# Altium schematic sheet SP8T_ecal_1.SchDoc
size B; SheetNumber: 1; SheetTotal: 3; SCH_REV: 2.0; SCH_TITLE_1: PXIe SP8T RF; SCH_TITLE_2: SCHEMATIC
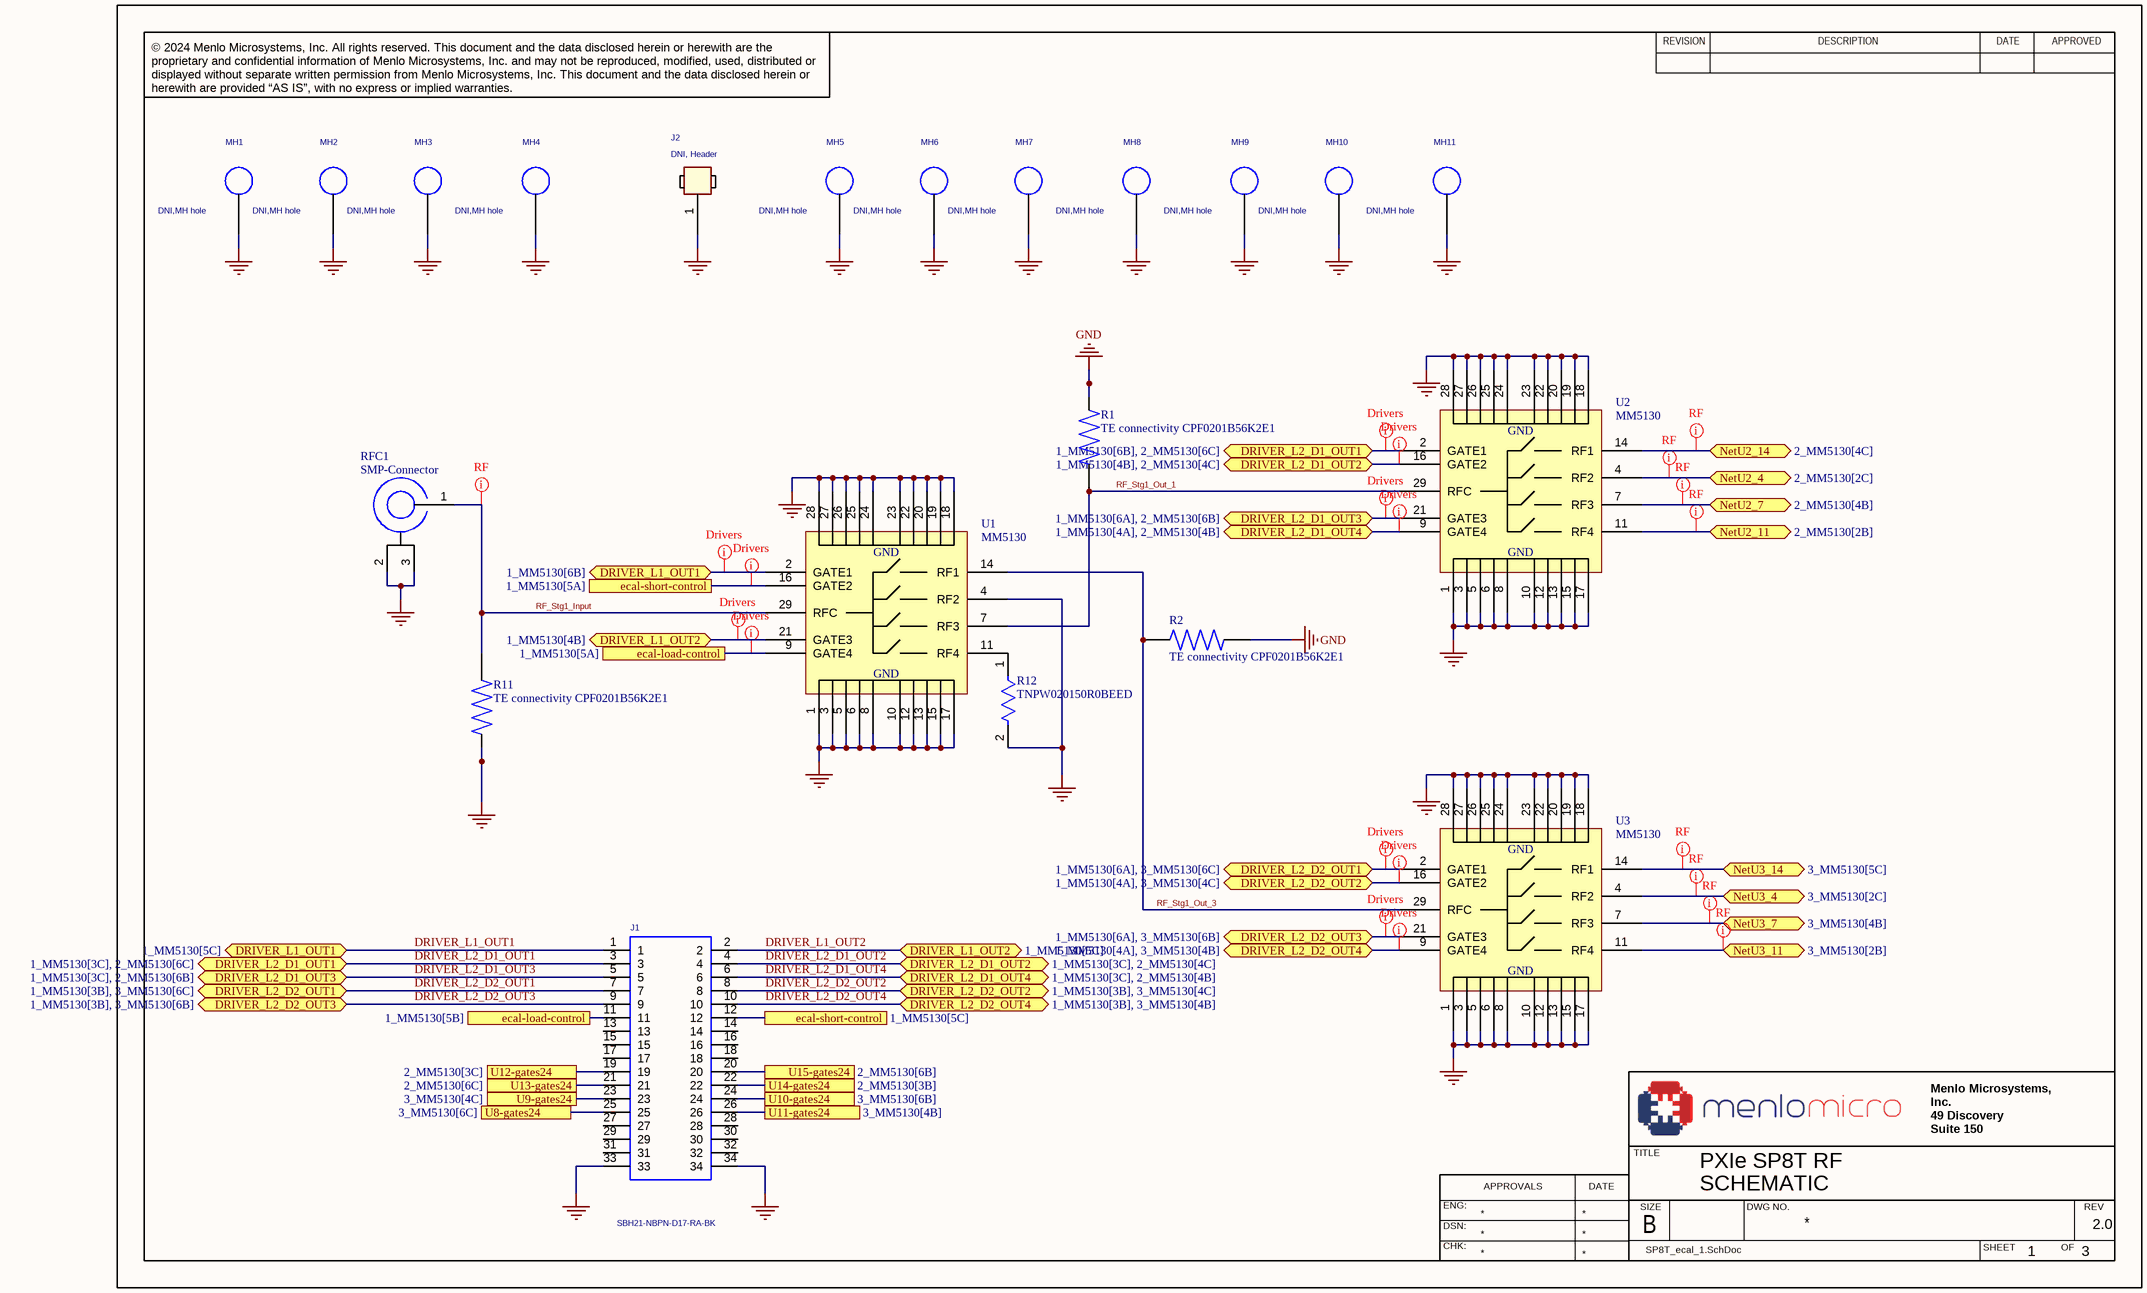
[diagram p0: SP8T_ecal_1.SchDoc]

## Parts
J1  SBH21-NBPN-D17-RA-BK  [SULLINS_SBH21-NBPN-D17-ST-B]
J2  DNI, Header  [tp_0035]
MH1  DNI,MH hole  [MH]
MH2  DNI,MH hole  [MH]
MH3  DNI,MH hole  [MH]
MH4  DNI,MH hole  [MH]
MH5  DNI,MH hole  [MH_55]
MH6  DNI,MH hole  [MH_55]
MH7  DNI,MH hole  [MH_55]
MH8  DNI,MH hole  [MH_55]
MH9  DNI,MH hole  [MH_55]
MH10  DNI,MH hole  [MH_55]
MH11  DNI,MH hole  [MH_55]
R1  TE connectivity CPF0201B56K2E1  [0201-resistor]
R2  TE connectivity CPF0201B56K2E1  [0201-resistor]
R11  TE connectivity CPF0201B56K2E1  [0201-resistor]
R12  TNPW020150R0BEED  [FP-ERJ1GN-IPC_C]
RFC1  Type: SMP-Connector  [CONN-PE44490]  (hidden comment: PE44490)
U1  MM5130  [MM5130-NORM_PCB_NOFLOOD]
U2  MM5130  [MM5130-NORM_PCB_NOFLOOD]
U3  MM5130  [MM5130-NORM_PCB_NOFLOOD]

## Ports
DRIVER_L1_OUT1 (bidir, see 1_MM5130[5C]), DRIVER_L1_OUT1 (bidir, see 1_MM5130[6B]), DRIVER_L1_OUT2 (bidir, see 1_MM5130[4B]), DRIVER_L1_OUT2 (bidir, see 1_MM5130[5C]), DRIVER_L2_D1_OUT1 (bidir, see 1_MM5130[3C], 2_MM5130[6C]), DRIVER_L2_D1_OUT1 (bidir, see 1_MM5130[6B], 2_MM5130[6C]), DRIVER_L2_D1_OUT2 (bidir, see 1_MM5130[3C], 2_MM5130[4C]), DRIVER_L2_D1_OUT2 (bidir, see 1_MM5130[4B], 2_MM5130[4C]), DRIVER_L2_D1_OUT3 (bidir, see 1_MM5130[3C], 2_MM5130[6B]), DRIVER_L2_D1_OUT3 (bidir, see 1_MM5130[6A], 2_MM5130[6B]), DRIVER_L2_D1_OUT4 (bidir, see 1_MM5130[3C], 2_MM5130[4B]), DRIVER_L2_D1_OUT4 (bidir, see 1_MM5130[4A], 2_MM5130[4B]), DRIVER_L2_D2_OUT1 (bidir, see 1_MM5130[3B], 3_MM5130[6C]), DRIVER_L2_D2_OUT1 (bidir, see 1_MM5130[6A], 3_MM5130[6C]), DRIVER_L2_D2_OUT2 (bidir, see 1_MM5130[3B], 3_MM5130[4C]), DRIVER_L2_D2_OUT2 (bidir, see 1_MM5130[4A], 3_MM5130[4C]), DRIVER_L2_D2_OUT3 (bidir, see 1_MM5130[3B], 3_MM5130[6B]), DRIVER_L2_D2_OUT3 (bidir, see 1_MM5130[6A], 3_MM5130[6B]), DRIVER_L2_D2_OUT4 (bidir, see 1_MM5130[3B], 3_MM5130[4B]), DRIVER_L2_D2_OUT4 (bidir, see 1_MM5130[4A], 3_MM5130[4B]), ecal-load-control (see 1_MM5130[5A]), ecal-load-control (see 1_MM5130[5B]), ecal-short-control (see 1_MM5130[5A]), ecal-short-control (see 1_MM5130[5C]), NetU2_4 (bidir, see 2_MM5130[2C]), NetU2_7 (bidir, see 2_MM5130[4B]), NetU2_11 (bidir, see 2_MM5130[2B]), NetU2_14 (bidir, see 2_MM5130[4C]), NetU3_4 (bidir, see 3_MM5130[2C]), NetU3_7 (bidir, see 3_MM5130[4B]), NetU3_11 (bidir, see 3_MM5130[2B]), NetU3_14 (bidir, see 3_MM5130[5C]), U8-gates24 (see 3_MM5130[6C]), U9-gates24 (see 3_MM5130[4C]), U10-gates24 (see 3_MM5130[6B]), U11-gates24 (see 3_MM5130[4B]), U12-gates24 (see 2_MM5130[3C]), U13-gates24 (see 2_MM5130[6C]), U14-gates24 (see 2_MM5130[3B]), U15-gates24 (see 2_MM5130[6B])

## Nets
GND: J1.33 J1.34 J2.1 MH1.1 MH2.1 MH3.1 MH4.1 MH5.1 MH6.1 MH7.1 MH8.1 MH9.1 MH10.1 MH11.1 R1.2 R2.1 R11.2 R12.2 RFC1.2 RFC1.3 U1.1(GND) U1.3(GND) U1.4(RF2) U1.5(GND) U1.6(GND) U1.8(GND) U1.10(GND) U1.12(GND) U1.13(GND) U1.15(GND) U1.17(GND) U1.18(GND) U1.19(GND) U1.20(GND) U1.22(GND) U1.23(GND) U1.24(GND) U1.25(GND) U1.26(GND) U1.27(GND) U1.28(GND) U2.1(GND) U2.3(GND) U2.5(GND) U2.6(GND) U2.8(GND) U2.10(GND) U2.12(GND) U2.13(GND) U2.15(GND) U2.17(GND) U2.18(GND) U2.19(GND) U2.20(GND) U2.22(GND) U2.23(GND) U2.24(GND) U2.25(GND) U2.26(GND) U2.27(GND) U2.28(GND) U3.1(GND) U3.3(GND) U3.5(GND) U3.6(GND) U3.8(GND) U3.10(GND) U3.12(GND) U3.13(GND) U3.15(GND) U3.17(GND) U3.18(GND) U3.19(GND) U3.20(GND) U3.22(GND) U3.23(GND) U3.24(GND) U3.25(GND) U3.26(GND) U3.27(GND) U3.28(GND)
DRIVER_L1_OUT1: J1.1 U1.2(GATE1) ; port DRIVER_L1_OUT1
DRIVER_L1_OUT2: J1.2 U1.21(GATE3) ; port DRIVER_L1_OUT2
DRIVER_L2_D1_OUT1: J1.3 U2.2(GATE1) ; port DRIVER_L2_D1_OUT1
DRIVER_L2_D1_OUT2: J1.4 U2.16(GATE2) ; port DRIVER_L2_D1_OUT2
DRIVER_L2_D1_OUT3: J1.5 U2.21(GATE3) ; port DRIVER_L2_D1_OUT3
DRIVER_L2_D1_OUT4: J1.6 U2.9(GATE4) ; port DRIVER_L2_D1_OUT4
DRIVER_L2_D2_OUT1: J1.7 U3.2(GATE1) ; port DRIVER_L2_D2_OUT1
DRIVER_L2_D2_OUT2: J1.8 U3.16(GATE2) ; port DRIVER_L2_D2_OUT2
DRIVER_L2_D2_OUT3: J1.9 U3.21(GATE3) ; port DRIVER_L2_D2_OUT3
DRIVER_L2_D2_OUT4: J1.10 U3.9(GATE4) ; port DRIVER_L2_D2_OUT4
ecal-load-control: J1.11 U1.9(GATE4) ; port ecal-load-control
ecal-short-control: J1.12 U1.16(GATE2) ; port ecal-short-control
NetU2_4: U2.4(RF2) ; port NetU2_4
NetU2_7: U2.7(RF3) ; port NetU2_7
NetU2_11: U2.11(RF4) ; port NetU2_11
NetU2_14: U2.14(RF1) ; port NetU2_14
NetU3_4: U3.4(RF2) ; port NetU3_4
NetU3_7: U3.7(RF3) ; port NetU3_7
NetU3_11: U3.11(RF4) ; port NetU3_11
NetU3_14: U3.14(RF1) ; port NetU3_14
RF_Stg1_Input: R11.1 RFC1.1 U1.29(RFC)
RF_Stg1_Out_1: R1.1 U1.7(RF3) U2.29(RFC)
RF_Stg1_Out_3: R2.2 U1.14(RF1) U3.29(RFC)
U8-gates24: J1.25 ; port U8-gates24
U9-gates24: J1.23 ; port U9-gates24
U10-gates24: J1.24 ; port U10-gates24
U11-gates24: J1.26 ; port U11-gates24
U12-gates24: J1.19 ; port U12-gates24
U13-gates24: J1.21 ; port U13-gates24
U14-gates24: J1.22 ; port U14-gates24
U15-gates24: J1.20 ; port U15-gates24
NetR12_1: R12.1 U1.11(RF4)

Not connected (* = marked no-connect by the designer): J1 13 14 15 16 17 18 27 28 29 30 31 32

## Layout directives
net class Drivers: DRIVER_L1_OUT1, DRIVER_L1_OUT2, DRIVER_L2_D1_OUT1, DRIVER_L2_D1_OUT2, DRIVER_L2_D1_OUT3, DRIVER_L2_D1_OUT4, DRIVER_L2_D2_OUT1, DRIVER_L2_D2_OUT2, DRIVER_L2_D2_OUT3, DRIVER_L2_D2_OUT4, ecal-load-control, ecal-short-control
net class RF: NetU2_4, NetU2_7, NetU2_11, NetU2_14, NetU3_4, NetU3_7, NetU3_11, NetU3_14, RF_Stg1_Input

## Notes on the sheet
- © 2024 Menlo Microsystems, Inc. All rights reserved. This document and the data disclosed herein or herewith are the proprietary and confidential information of Menlo Microsystems, Inc. and may not be reproduced, modified, used, distributed or displayed without separate written permission from Menlo Microsystems, Inc. This document and the data disclosed herein or herewith are provided “AS IS”, with no express or implied warranties.
- REVISION
- DESCRIPTION
- DATE
- APPROVED
- TITLE
- Menlo Microsystems, Inc.
  49 Discovery
  Suite 150
  Irvine, CA 92618
- ENG:
- DSN:
- CHK:
- APPROVALS
- SIZE
- B
- DWG NO.
- SHEET
- OF
- REV

## Library data of the parts
J1 = SBH21-NBPN-D17-ST-BK: Connector Header Through Hole 34 position 0.079 _2.00mm_; OriginalSymbolOrigin: (-30000,90000); Package: None; Availability: Unavailable; Price: None
J2 = HEADER 1
MH1-MH11 = M HOLE1_0
R1 R2 R11 = TE connectivity CPF0201B56K2E1: CPF 0201 56K2 0.1% 25PPM 1K RL; MP: ERJ1GN0R00C; Value: 56k; Availability: Unavailable; Price: None; Package: None; Mfgr: TE connectivity; Mfgr Part No.: CPF0201B56K2E1
R12 = CMP-1010-00416-3: RES SMD 50 OHM 0.1% 1/20W 0201; Temperature Coefficient: 200ppm/°C; Resistance Tolerance: 1%; Max Power Dissipation: 50mW; Voltage Rating (DC): 25V; Resistance: 1kR; Number of Pins: 2; Height: 0.01inch; Weight: 6E-06oz; Min Operating Temperature: -55°C; Features: Automotive AEC-Q200; Radiation Hardening: No; Resistor Type: Thick Film; RoHS Compliant: Yes; Termination: SMD/SMT; Package Quantity: 15000; Size Code: 0201; Case Code (Imperial): 0201; Contact Plating: Tin; Case/Package: 0201; Lead Free: Lead Free; Number of Terminations: 2; Tolerance: 1%; Max Operating Temperature: 125°C; Mount: Surface Mount; Width: 0.012inch; Series: ERJ; Voltage Rating: 25V; Power Rating: 50mW; Packaging: Tape and Reel; Length: 0.6mm; Case Code (Metric): 0603
RFC1 = CONN-PE44490: SMP, Mini Connector Plug, Male Pin 50 Ohms Board Edge, Cutout; Surface Mount Solder; Manufacturer: Pasternack; Manufacturer_Part_Number: PE44490
U1-U3 = IC-MM5130: High power SP4T MEMs switch